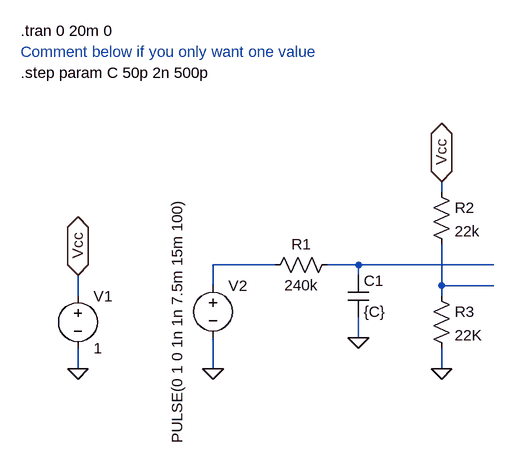
[diagram p0: schematic MS.asc]
MS.asc, the LTspice schematic file:
Version 4
SHEET 1 880 680
WIRE 352 64 352 48
WIRE 96 176 0 176
WIRE 224 176 176 176
WIRE 432 176 224 176
WIRE 224 192 224 176
WIRE 0 208 0 176
WIRE 352 208 352 144
WIRE 432 208 352 208
WIRE -208 224 -208 192
WIRE 352 224 352 208
WIRE 224 288 224 256
WIRE -208 336 -208 304
WIRE 0 336 0 288
WIRE 352 336 352 304
FLAG 224 288 0
FLAG 352 336 0
FLAG -208 336 0
FLAG -208 192 Vcc
IOPIN -208 192 BiDir
FLAG 0 336 0
FLAG 352 48 Vcc
IOPIN 352 48 BiDir
SYMBOL res 192 160 R90
WINDOW 0 0 56 VBottom 2
WINDOW 3 32 56 VTop 2
SYMATTR InstName R1
SYMATTR Value 240k
SYMBOL cap 208 192 R0
SYMATTR InstName C1
SYMATTR Value {C}
SYMBOL res 336 48 R0
SYMATTR InstName R2
SYMATTR Value 22k
SYMBOL res 336 208 R0
SYMATTR InstName R3
SYMATTR Value 22K
SYMBOL voltage -208 208 R0
WINDOW 123 0 0 Left 2
WINDOW 39 0 0 Left 2
SYMATTR InstName V1
SYMATTR Value 1
SYMBOL voltage 0 192 R0
WINDOW 3 -55 -119 VRight 2
WINDOW 123 0 0 Left 2
WINDOW 39 0 0 Left 2
SYMATTR Value PULSE(0 1 0 1n 1n 7.5m 15m 100)
SYMATTR InstName V2
TEXT -296 -184 Left 2 !.tran 0 20m 0
TEXT -296 -120 Left 2 !.step param C 50p 2n 500p
TEXT -296 -152 Left 2 ;Comment below if you only want one value

The netlist it stands for:
* MS.asc
R1 N002 N001 240k
C1 N002 0 {C}
R2 Vcc N003 22k
R3 N003 0 22K
V1 Vcc 0 1
V2 N001 0 PULSE(0 1 0 1n 1n 7.5m 15m 100)
.tran 0 20m 0
.step param C 50p 2n 500p
* Comment below if you only want one value
.backanno
.end